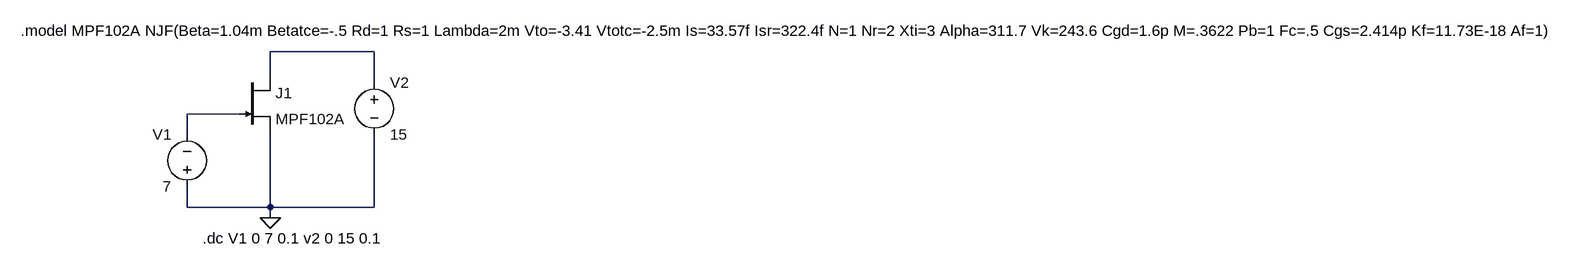
[diagram p0: schematic Sim-salidajfet.asc]
Sim-salidajfet.asc, the LTspice schematic file:
Version 4.1
SHEET 1 2632 680
WIRE 400 32 240 32
WIRE 240 64 240 32
WIRE 400 80 400 32
WIRE 192 128 112 128
WIRE 112 160 112 128
WIRE 112 272 112 240
WIRE 240 272 240 160
WIRE 240 272 112 272
WIRE 400 272 400 160
WIRE 400 272 240 272
WIRE 240 288 240 272
FLAG 240 288 0
SYMBOL voltage 112 256 R180
WINDOW 0 24 96 Left 2
WINDOW 3 24 16 Left 2
SYMATTR InstName V1
SYMATTR Value 7
SYMBOL njf 192 64 R0
SYMATTR InstName J1
SYMATTR Value MPF102A
SYMBOL voltage 400 64 R0
SYMATTR InstName V2
SYMATTR Value 15
TEXT 136 320 Left 2 !.dc V1 0 7 0.1 v2 0 15 0.1
TEXT -144 0 Left 2 !.model MPF102A NJF(Beta=1.04m Betatce=-.5 Rd=1 Rs=1 Lambda=2m Vto=-3.41 Vtotc=-2.5m Is=33.57f Isr=322.4f N=1 Nr=2 Xti=3 Alpha=311.7 Vk=243.6 Cgd=1.6p M=.3622 Pb=1 Fc=.5 Cgs=2.414p Kf=11.73E-18 Af=1)

The netlist it stands for:
* Sim-salidajfet.asc
V1 0 N002 7
J1 N001 N002 0 MPF102A
V2 N001 0 15
.model NJF NJF
.model PJF PJF
.lib standard.jft
.dc V1 0 7 0.1 v2 0 15 0.1
.model MPF102A NJF(Beta=1.04m Betatce=-.5 Rd=1 Rs=1 Lambda=2m Vto=-3.41 Vtotc=-2.5m Is=33.57f Isr=322.4f N=1 Nr=2 Xti=3 Alpha=311.7 Vk=243.6 Cgd=1.6p M=.3622 Pb=1 Fc=.5 Cgs=2.414p Kf=11.73E-18 Af=1)
.backanno
.end